# EAGLE design Transistor_as_Not_gate (EAGLE 9.6.2)
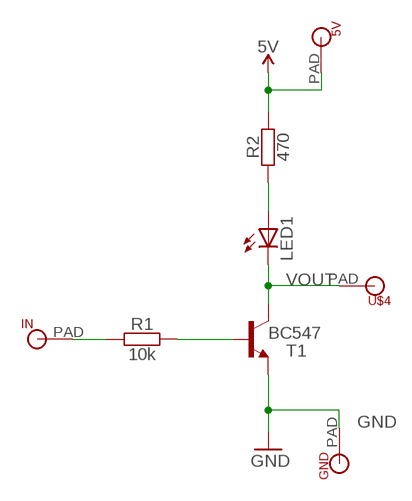
[diagram p0: schematic, sheet 1]

## Parts
5V  MICROBIT_PAD  [MICROBIT_PAD]
GND  MICROBIT_PAD  [MICROBIT_PAD]
IN  MICROBIT_PAD  [MICROBIT_PAD]
LED1  LED3MM  [LED3MM]
R1  10k  RESISTOR-07  [R0207/7]
R2  470  RESISTOR-07  [R0207/7]
T1  BC547  [TO92]
U$4  MICROBIT_PAD  [MICROBIT_PAD]

## Nets
5V: 5V.PAD R2.2
GND: GND.PAD T1.1(E)
N$1: R1.2 T1.2(B)
N$3: LED1.A R2.1
N$4: IN.PAD R1.1
VOUT: LED1.K(C) T1.3(C) U$4.PAD

## Library data of the parts
5V GND IN U$4 = microbit:MICROBIT_PAD
LED1 = adafruit:LED: LED OSRAM: - CHIPLED LG R971, LG N971, LY N971, LG Q971, LY Q971, LO R971, LY R971 LH N974, LH R974 LS Q976, LO Q976, LY Q976 LO Q996 - Hyper CHIPLED LW Q18S LB Q993, LB Q99A, LB R99A - SideLED LS A670, LO A670, LY A670, LG A670, LP A670 LB A673, LV A673, LT A673, LW A673 LH A674 LY A675 LS A676, LA A676, LO A676, LY A676, LW A676 LS A679, LY A679, LG A679 - Hyper Micro SIDELED® LS Y876, LA Y876, LO Y876, LY Y876 LT Y87S - SmartLED LW L88C, LW L88S LB L89C, LB L89S, LG L890 LS L89K, LO L89K, LY L89K LS L896, LA L896, LO L896, LY L896 - TOPLED LS T670, LO T670, LY T670, LG T670, LP T670 LSG T670, LSP T670, LSY T670, LOP T670, LYG T670 LG T671, LOG T671, LSG T671 LB T673, LV T673, LT T673, LW T673 LH T674 LS T676, LA T676, LO T676, LY T676, LB T676, LH T676, LSB T676, LW T676 LB T67C, LV T67C, LT T67C, LS T67K, LO T67K, LY T67K, LW E67C LS E67B, LA E67B, LO E67B, LY E67B, LB E67C, LV E67C, LT E67C LW T67C LS T679, LY T679, LG T679 LS T770, LO T770, LY T770, LG T770, LP T770 LB T773, LV T773, LT T773, LW T773 LH T774 LS E675, LA E675, LY E675, LS T675 LS T776, LA T776, LO T776, LY T776, LB T776 LHGB T686 LT T68C, LB T68C - Hyper Mini TOPLED® LB M676 - Mini TOPLED Santana® LG M470 LS M47K, LO M47K, LY M47K Source: http://www.osram.convergy.de/
R1 R2 = we-rcl:RESISTOR: Resistor all kinds in 0402 and 0603
T1 = transistor:BC547: NPN TRANSISTOR

## Board
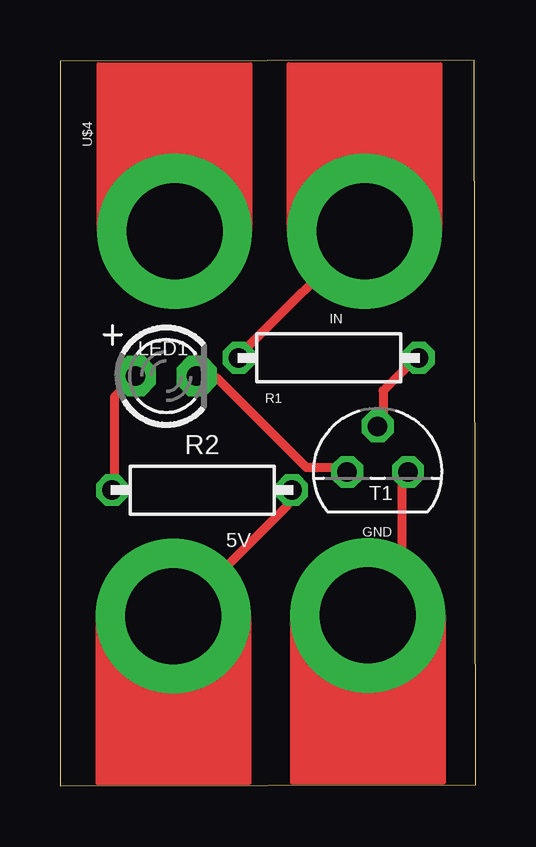
[diagram p1: board, top side]
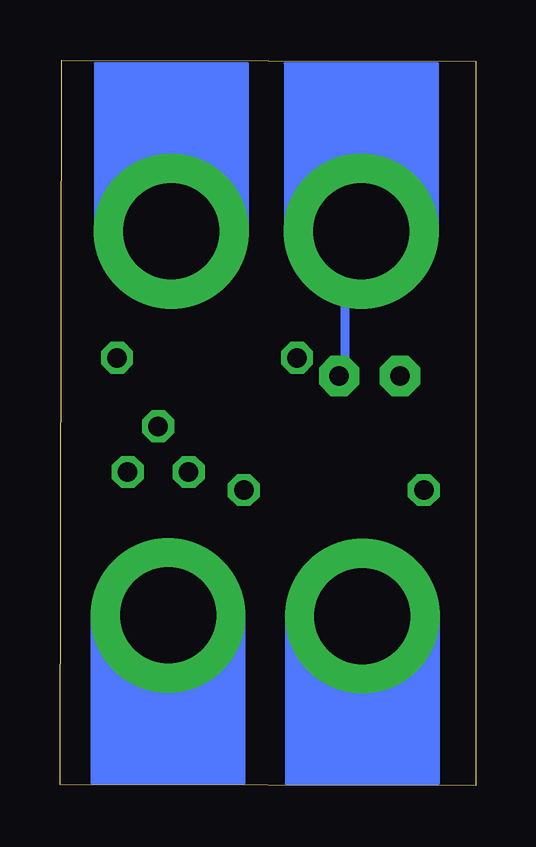
[diagram p2: board, bottom side, seen from below]

Size 17.33 x 30.24 mm. Coordinates in mm from the lower left corner, seen from the top.
Outline: 0,0 17.33,0.05 17.26,30.24 0,30.2 0,0
Copper layers (1*16): Top 0.035mm / dielectric 1.5mm / Bottom 0.035mm
Design rules "default *": minimum track width 15mil, minimum drill 0.35mm, track to track 6mil, track to pad 6mil, pad to pad 6mil, via to via 6mil, smd to smd 6mil, copper to edge 40mil, drill to drill 6mil, minimum pad ring 10mil, minimum via ring 8mil, stop-mask expansion 4mil, vias tented up to drill 0mil, thermal gap 10mil

### Footprints (pad centres in the part's own frame; a part is rotated, then mirrored left to right if it is on the bottom)
MICROBIT_PAD = drill 4 pad 6.452: PAD 0,0
LED3MM = drill 0.813 pad 1.676 octagon: A -1.27,0; K 1.27,0
R0207/7 = drill 0.813 octagon: 1 -3.75,0; 2 3.75,0
TO92 = drill 0.813 octagon: 1 1.27,0; 2 0,1.905; 3 -1.27,0

### Placement (x,y rotation side)
5V  4.73,7.07 0 top
GND  12.83,7.1 0 top
IN  12.69,23.11 180 top
LED1  4.43,17.07 0 top
R1  11.2,17.83 0 top
R2  5.92,12.32 0 top
T1  13.24,13.07 0 top
U$4  4.77,23.1 180 top

### Tracks (layer width: path | path; a pad name or v marks a point on that pad's centre or on a via)
5V
  Top 0.381: R2.2 9.47,12.2 9.47,11.66 4.93,7.13 5V.PAD
GND
  Top 0.381: T1.1 14.27,13 14.27,8.46 12.94,7.13 GND.PAD
N$1
  Top 0.381: T1.2 13.47,15.13 13.47,16.47 14.8,17.8 R1.2
N$3
  Top 0.381: R2.1 2.27,12.46 2.27,16.2 3.07,17 LED1.A
N$4
  Top 0.381: R1.1 7.6,18.07 12.67,23.13 IN.PAD
VOUT
  Top 0.381: T1.3 11.87,13.26 10.27,13.26 6.53,17 5.73,17 LED1.K
  Bottom 0.381: LED1.K 5.47,17.27 5.47,22.33 4.93,22.87 U$4.PAD